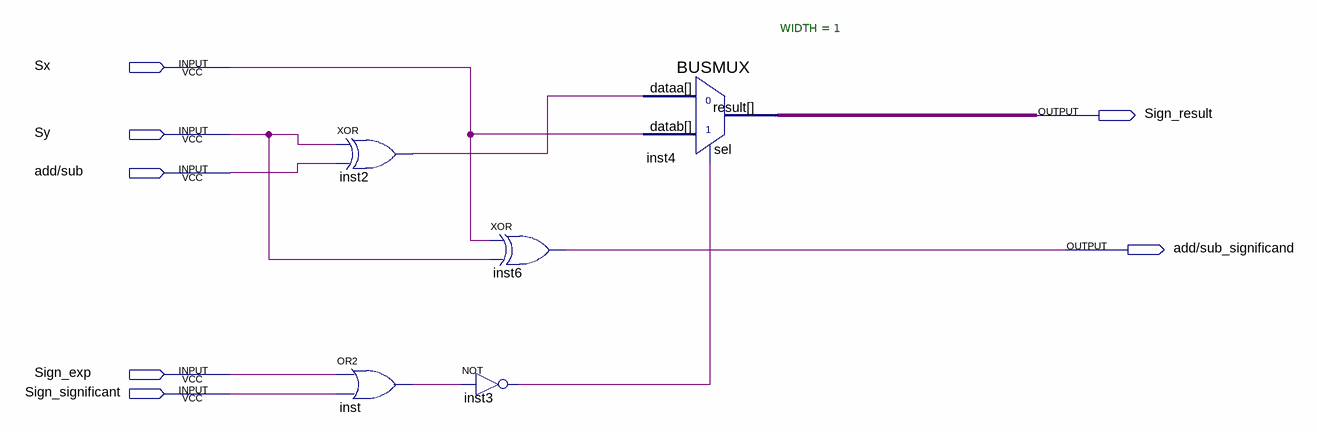
[diagram p0: schematic sheet]
// Quartus schematic sign_computation.bdf as structural Verilog: 5 symbols, 7 pins
module sign_computation (
  input  Sx,
  input  Sy,
  input  \add/sub ,
  input  Sign_exp,
  input  Sign_significant,
  output Sign_result,
  output \add/sub_significand 
);

  wire inst2_out, inst3_out, inst_out;

  xor inst2 (inst2_out, Sy, \add/sub );
  or inst (inst_out, Sign_exp, Sign_significant);
  xor inst6 (\add/sub_significand , Sx, Sy);
  not inst3 (inst3_out, inst_out);
  BUSMUX #(.WIDTH(1)) inst4 (.datab(Sx), .sel(inst3_out), .dataa(inst2_out), .result(Sign_result));
endmodule
